# EAGLE design Omni-BASIC-TOP (EAGLE 9.6.2)
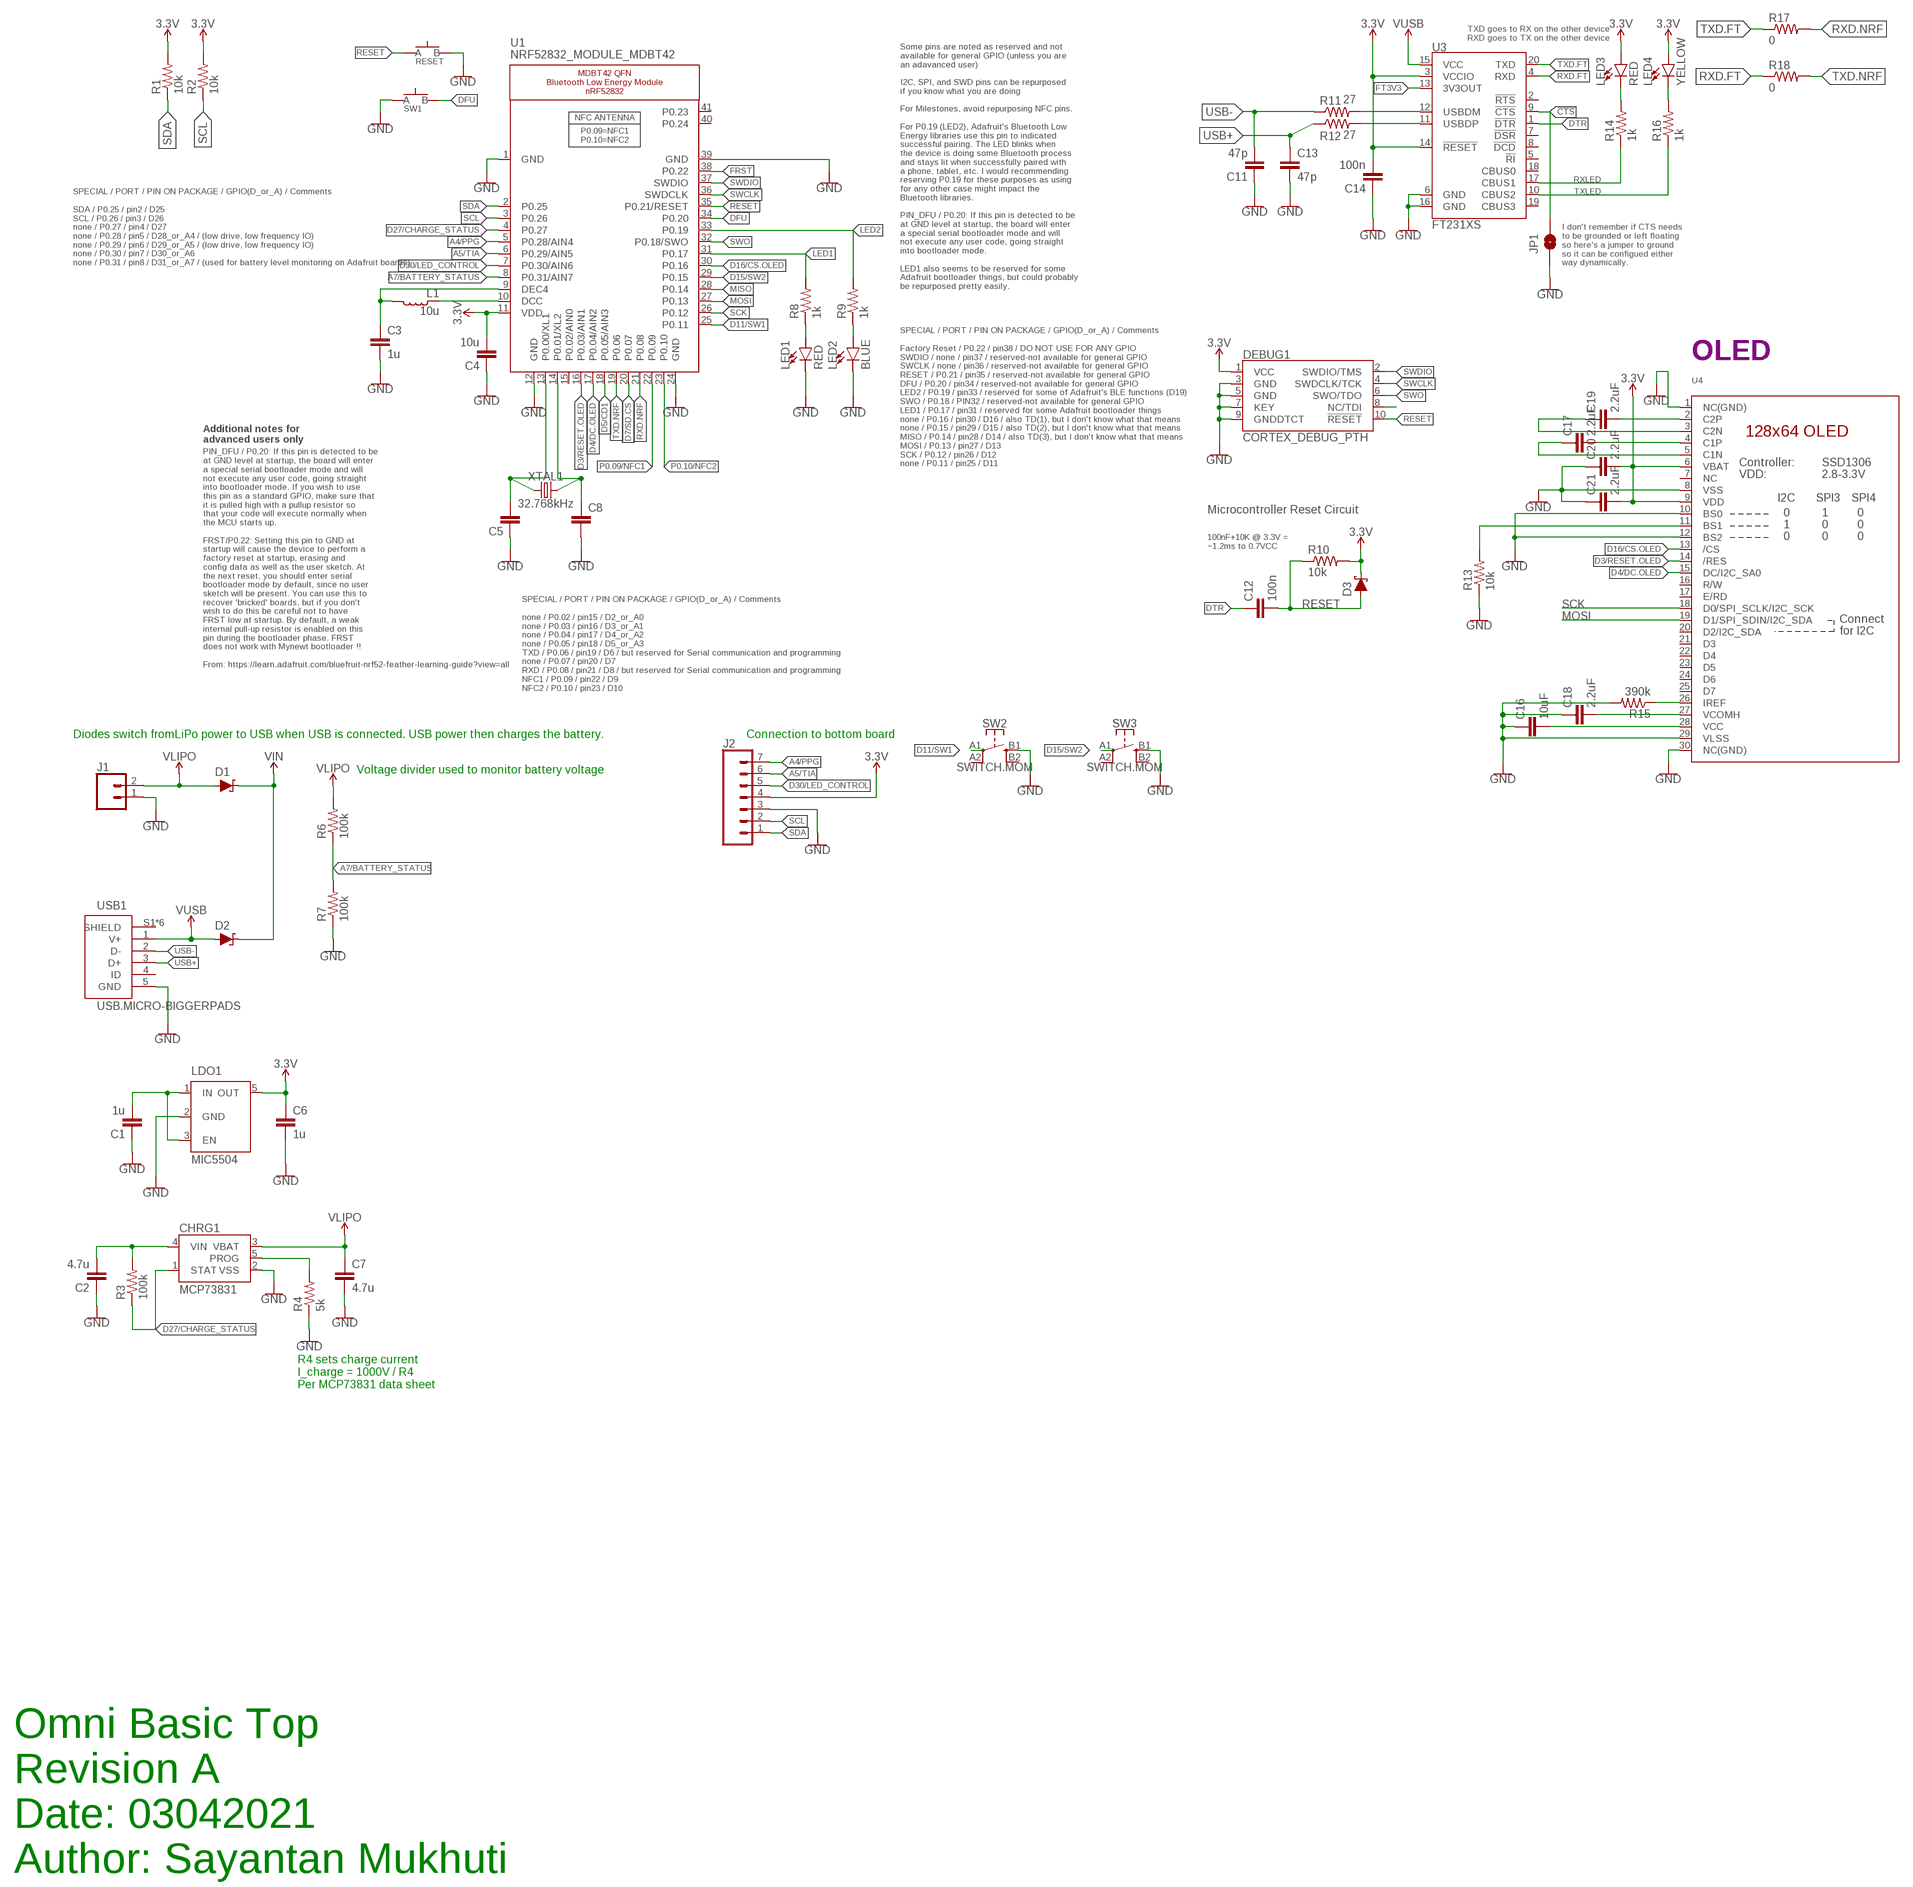
[diagram p0: schematic, sheet 1]

## Parts
C1  1u  CAPACITOR0603  [C0603]
C2  4.7u  CAPACITOR0603  [C0603]
C3  1u  CAPACITOR0603  [C0603]
C4  10u  CAPACITOR0805  [C0805]
C5  CAPACITOR0603  [C0603]
C6  1u  CAPACITOR0603  [C0603]
C7  4.7u  CAPACITOR0603  [C0603]
C8  CAPACITOR0603  [C0603]
C11  47p  CAPACITOR0603  [C0603]
C12  100n  CAPACITOR0603  [C0603]
C13  47p  CAPACITOR0603  [C0603]
C14  100n  CAPACITOR0603  [C0603]
C16  10uF  CAPACITOR0603  [C0603]
C17  2.2uF  CAPACITOR0402  [C0402]
C18  2.2uF  CAPACITOR0402  [C0402]
C19  2.2uF  CAPACITOR0402  [C0402]
C20  2.2uF  CAPACITOR0402  [C0402]
C21  2.2uF  CAPACITOR0402  [C0402]
CHRG1  MCP73831  [SOT23-5]
D1  SCHOTTKY-USC  [USC]
D2  SCHOTTKY-USC  [USC]
D3  SCHOTTKY-USC  [USC]
DEBUG1  CORTEX_DEBUG_PTH  [2X5-PTH-1.27MM]
J1  CONN_02  [1X02]
J2  CONN_07-1.27MM  [1X07_1.27MM]
JP1  JUMPER-SMT_2_NO_SILK  [SMT-JUMPER_2_NO_SILK]
L1  10u  INDUCTOR0603  [L0603]
LDO1  MIC5504  [SOT23-5]
LED1  RED  LED0603  [LED-0603]
LED2  BLUE  LED0603  [LED-0603]
LED3  RED  LED0603  [LED-0603]
LED4  YELLOW  LED0603  [LED-0603]
R1  10k  RESISTOR0603  [R0603]
R2  10k  RESISTOR0603  [R0603]
R3  100k  RESISTOR0603  [R0603]
R4  5k  RESISTOR0603  [R0603]
R6  100k  RESISTOR0603  [R0603]
R7  100k  RESISTOR0603  [R0603]
R8  1k  RESISTOR0603  [R0603]
R9  1k  RESISTOR0603  [R0603]
R10  10k  RESISTOR0603  [R0603]
R11  27  RESISTOR0603  [R0603]
R12  27  RESISTOR0603  [R0603]
R13  10k  RESISTOR0603  [R0603]
R14  1k  RESISTOR0603  [R0603]
R15  390k  RESISTOR0603  [R0603]
R16  1k  RESISTOR0603  [R0603]
R17  0  RESISTOR0603  [R0603]
R18  0  RESISTOR0603  [R0603]
RESET  SPST-PTS830GG140-COPY.1-3  [BUTTON-GULLWING]
SW1  SPST-PTS830GG140-COPY.1-3  [BUTTON-GULLWING]
SW2  SWITCH.MOM  [TACTILE_SWITCH_SMD_6.2MM_TALL]
SW3  SWITCH.MOM  [TACTILE_SWITCH_SMD_6.2MM_TALL]
U1  NRF52832_MODULE_MDBT42  [BLE_MODULE_RAYTAC_MDBT42]
U3  FT231XS  [SSOP20_L]
U4  DISP_OLED_UG-2864HSWEG01-NO-WRAPAROUND  [UG-2864HSWEG01_0.96IN_NO-WRAPAROUND]
USB1  USB.MICRO-BIGGERPADS  [USB-MICRO-01.BIGGERPADS]
XTAL1  32.768kHz  CRYSTALECS-.327-12.5-12-C-TR  [2-SMD.NOLEAD.2.0MMTO1.2MM]

## Nets
3.3V: C4.2 C6.1 C14.2 C20.2 C21.2 D3.-(C) DEBUG1.1(VCC) J2.4 LDO1.5(OUT) LED3.A LED4.A R1.2 R2.2 R10.2 U1.11(VDD) U3.3(VCCIO) U3.14(!RESET) U4.6(VBAT) U4.9(VDD)
!CTS: JP1.2 U3.9(!CTS)
A4/PPG: J2.7 U1.5(P0.28/AIN4)
A5/TIA: J2.6 U1.6(P0.29/AIN5)
A7/BATTERY_STATUS: R6.1 R7.2 U1.8(P0.31/AIN7)
D3/RESET.OLED: U1.16(P0.03/AIN1) U4.14(/RES)
D4/DC.OLED: U1.17(P0.04/AIN2) U4.15(DC/I2C_SA0)
D5/CD1: U1.18(P0.05/AIN3)
D7/SD.CS: U1.20(P0.07)
D11/SW1: SW2.A1 U1.25(P0.11)
D15/SW2: SW3.A1 U1.29(P0.15)
D16/CS.OLED: U1.30(P0.16) U4.13(/CS)
D27/CHARGE_STATUS: CHRG1.1(STAT) R3.1 U1.4(P0.27)
D30/LED_CONTROL: J2.5 U1.7(P0.30/AIN6)
DFU: SW1.3(B) U1.34(P0.20)
DTR: C12.1 U3.1(!DTR)
FRST: U1.38(P0.22)
FT3V3: U3.13(3V3OUT)
GND: C1.1 C2.1 C3.2 C4.1 C5.1 C6.2 C7.2 C8.2 C11.1 C13.2 C14.1 C16.1 C18.1 C20.1 C21.1 CHRG1.2(VSS) DEBUG1.3(GND) DEBUG1.5(GND) DEBUG1.7(KEY) DEBUG1.9(GNDDTCT) J1.1 J2.3 JP1.1 LDO1.2(GND) LED1.C LED2.C R4.1 R7.1 R13.1 R15.2 RESET.3(B) SW1.1(A) SW2.B1 SW3.B1 U1.1(GND) U1.12(GND) U1.24(GND) U1.39(GND) U3.6(GND) U3.16(GND) U4.1(NC(GND)) U4.8(VSS) U4.10(BS0) U4.12(BS2) U4.29(VLSS) U4.30(NC(GND)) USB1.5(GND)
LED1: R8.2 U1.31(P0.17)
LED2: R9.2 U1.33(P0.19)
MISO: U1.28(P0.14)
MOSI: U1.27(P0.13) U4.19(D1/SPI_SDIN/I2C_SDA)
N$1: R13.2 U4.11(BS1)
N$2: R15.1 U4.26(IREF)
N$3: C19.2 U4.2(C2P)
N$4: C5.2 U1.13(P0.00/XL1) XTAL1.P$1
N$5: C19.1 U4.3(C2N)
N$6: C8.1 U1.14(P0.01/XL2) XTAL1.P$2
N$7: C17.2 U4.4(C1P)
N$8: C17.1 U4.5(C1N)
N$9: LED1.A R8.1
N$10: LED2.A R9.1
N$11: L1.1 U1.10(DCC)
N$12: C3.1 L1.2 U1.9(DEC4)
N$13: C16.2 U4.28(VCC)
N$14: DEBUG1.8(NC/TDI)
N$15: C18.2 U4.27(VCOMH)
N$16: CHRG1.5(PROG) R4.2
N$23: R11.2 U3.12(USBDM)
N$24: R12.2 U3.11(USBDP)
N$25: LED3.C R14.2
N$26: LED4.C R16.2
P0.09/NFC1: U1.22(P0.09)
P0.10/NFC2: U1.23(P0.10)
RESET: C12.2 D3.+(A) DEBUG1.10(!RESET) R10.1 RESET.1(A) U1.35(P0.21/RESET)
RXD.FT: R18.1 U3.4(RXD)
RXD.NRF: R17.2 U1.21(P0.08)
RXLED: R14.1 U3.17(CBUS1)
SCK: U1.26(P0.12) U4.18(D0/SPI_SCLK/I2C_SCK)
SCL: J2.2 R2.1 U1.3(P0.26)
SDA: J2.1 R1.1 U1.2(P0.25)
SWCLK: DEBUG1.4(SWDCLK/TCK) U1.36(SWDCLK)
SWDIO: DEBUG1.2(SWDIO/TMS) U1.37(SWDIO)
SWO: DEBUG1.6(SWO/TDO) U1.32(P0.18/SWO)
TXD.FT: R17.1 U3.20(TXD)
TXD.NRF: R18.2 U1.19(P0.06)
TXLED: R16.1 U3.10(CBUS2)
USB+: C13.1 R12.1 USB1.3(D+)
USB-: C11.2 R11.1 USB1.2(D-)
V_USB: D2.+(A) U3.15(VCC) USB1.1(V+) ; supply symbol labelled VUSB
VIN: C1.2 C2.2 CHRG1.4(VIN) D1.-(C) D2.-(C) LDO1.1(IN) LDO1.3(EN) R3.2
VLIPO: C7.1 CHRG1.3(VBAT) D1.+(A) J1.2 R6.2
Unconnected: SW2.A2 SW2.B2 SW3.A2 SW3.B2 U1.15(P0.02/AIN0) U1.40(P0.24) U1.41(P0.23) U3.2(!RTS) U3.5(!RI) U3.7(!DSR) U3.8(!DCD) U3.18(CBUS0) U3.19(CBUS3) U4.7(NC) U4.16(R/W) U4.17(E/RD) U4.20(D2/I2C_SDA) U4.21(D3) U4.22(D4) U4.23(D5) U4.24(D6) U4.25(D7) USB1.4(ID) USB1.S1(SHIELD) USB1.S2(SHIELD) USB1.S3(SHIELD) USB1.S4(SHIELD) USB1.S5(SHIELD) USB1.S6(SHIELD)

## Notes on the sheet
- TXD goes to RX on the other device
  RXD goes to TX on the other device
- SPECIAL / PORT / PIN ON PACKAGE / GPIO(D_or_A) / Comments
  
  SDA / P0.25 / pin2 / D25
  SCL / P0.26 / pin3 / D26
  none / P0.27 / pin4 / D27
  none / P0.28 / pin5 / D28_or_A4 / (low drive, low frequency IO)
  none / P0.29 / pin6 / D29_or_A5 / (low drive, low frequency IO)
  none / P0.30 / pin7 / D30_or_A6
  none / P0.31 / pin8 / D31_or_A7 / (used for battery level monitoring on Adafruit boards)
- I don't remember if CTS needs
  to be grounded or left floating
  so here's a jumper to ground
  so it can be configued either
  way dynamically.
- Some pins are noted as reserved and not
  available for general GPIO (unless you are
  an adavanced user)
  
  I2C, SPI, and SWD pins can be repurposed
  if you know what you are doing
  
  For Milestones, avoid repurposing NFC pins.
  
  For P0.19 (LED2), Adafruit's Bluetooth Low
  Energy libraries use this pin to indicated
  successful pairing. The LED blinks when
  the device is doing some Bluetooth process
  and stays lit when successfully paired with
  a phone, tablet, etc. I would recommending
  reserving P0.19 for these purposes as using
  for any other case might impact the
  Bluetooth libraries.
  
  PIN_DFU / P0.20: If this pin is detected to be
  at GND level at startup, the board will enter
  a special serial bootloader mode and will
  not execute any user code, going straight
  into bootloader mode.
  
  LED1 also seems to be reserved for some
  Adafruit bootloader things, but could probably
  be repurposed pretty easily.
- OLED
- Additional notes for
  advanced users only
- SPECIAL / PORT / PIN ON PACKAGE / GPIO(D_or_A) / Comments
  
  Factory Reset / P0.22 / pin38 / DO NOT USE FOR ANY GPIO
  SWDIO / none / pin37 / reserved-not available for general GPIO
  SWCLK / none / pin36 / reserved-not available for general GPIO
  RESET / P0.21 / pin35 / reserved-not available for general GPIO
  DFU / P0.20 / pin34 / reserved-not available for general GPIO
  LED2 / P0.19 / pin33 / reserved for some of Adafruit's BLE functions (D19)
  SWO / P0.18 / PIN32 / reserved-not available for general GPIO
  LED1 / P0.17 / pin31 / reserved for some Adafruit bootloader things
  none / P0.16 / pin30 / D16 / also TD(1), but I don't know what that means
  none / P0.15 / pin29 / D15 / also TD(2), but I don't know what that means
  MISO / P0.14 / pin28 / D14 / also TD(3), but I don't know what that means
  MOSI / P0.13 / pin27 / D13
  SCK / P0.12 / pin26 / D12
  none / P0.11 / pin25 / D11
- Microcontroller Reset Circuit
- 100nF+10K @ 3.3V =
  ~1.2ms to 0.7VCC
- PIN_DFU / P0.20: If this pin is detected to be
  at GND level at startup, the board will enter
  a special serial bootloader mode and will
  not execute any user code, going straight
  into bootloader mode. If you wish to use
  this pin as a standard GPIO, make sure that
  it is pulled high with a pullup resistor so
  that your code will execute normally when
  the MCU starts up.
  
  FRST/P0.22: Setting this pin to GND at
  startup will cause the device to perform a
  factory reset at startup, erasing and
  config data as well as the user sketch. At
  the next reset, you should enter serial
  bootloader mode by default, since no user
  sketch will be present. You can use this to
  recover 'bricked' boards, but if you don't
  wish to do this be careful not to have
  FRST low at startup. By default, a weak
  internal pull-up resistor is enabled on this
  pin during the bootloader phase. FRST
  does not work with Mynewt bootloader !!
  
  From: https://learn.adafruit.com/bluefruit-nrf52-feather-learning-guide?view=all
- SPECIAL / PORT / PIN ON PACKAGE / GPIO(D_or_A) / Comments
  
  none / P0.02 / pin15 / D2_or_A0
  none / P0.03 / pin16 / D3_or_A1
  none / P0.04 / pin17 / D4_or_A2
  none / P0.05 / pin18 / D5_or_A3
  TXD / P0.06 / pin19 / D6 / but reserved for Serial communication and programming
  none / P0.07 / pin20 / D7
  RXD / P0.08 / pin21 / D8 / but reserved for Serial communication and programming
  NFC1 / P0.09 / pin22 / D9
  NFC2 / P0.10 / pin23 / D10
- Diodes switch fromLiPo power to USB when USB is connected. USB power then charges the battery. | Connection to bottom board
- Voltage divider used to monitor battery voltage
- R4 sets charge current
  I_charge = 1000V / R4
  Per MCP73831 data sheet
- Omni Basic Top
  Revision A
  Date: 03042021
  Author: Sayantan Mukhuti

## Library data of the parts
C1-C8 C11-C14 = LinnesLab-Passives:CAPACITOR
C16-C21 = LinnesLab-Passives:CAPACITOR; SPICEPREFIX: C
CHRG1 = LinnesLab-Power:MCP73831: MCP73831T Li-Ion, Li-Pol Controller Miniature single cell, fully integrated Li-Ion, Li-polymer charge management controller Datasheet <http://ww1.microchip.com/downloads/en/DeviceDoc/20001984g.pdf> SparkFun Products: SparkFun ESP32 Thing <https://www.sparkfun.com/products/13907> SparkFun 9DoF Razor IMU M0 <https://www.sparkfun.com/products/14001>; PROD_ID: IC-09995
D1-D3 = LinnesLab-DiscreteSemi:SCHOTTKY: Schottky diode A Schottky diode is a semiconductor diode which has a low forward voltage drop and a very fast switching action. Example: Digi-Key Part Number: RB161MM-20CT-ND
DEBUG1 = LinnesLab-Connectors:CORTEX_DEBUG: Cortex Debug Connector - 10 pin Supports JTAG debug, Serial Wire debug, and Serial Wire Viewer. PTH and SMD connector options available. General Connector Information <http://infocenter.arm.com/help/topic/com.arm.doc.faqs/attached/13634/cortex_debug_connectors.pdf> Products: PTH Connector <http://www.digikey.com/product-detail/en/cnc-tech/3220-10-0100-00/1175-1627-ND/3883661> -via Digi-Key SparkFun PSoc <https://www.sparkfun.com/products/13229> SparkFun T <https://www.sparkfun.com/products/13810>
J1 = LinnesLab-Connectors:CONN_02: Multi connection point. Often used as Generic Header-pin footprint for 0.1 inch spaced/style header connections On any of the 0.1 inch spaced packages, you can populate with these: Break Away Headers - Straight <https://www.sparkfun.com/products/116> (PRT-00116) Break Away Male Headers - Right Angle <https://www.sparkfun.com/products/553> (PRT-00553) Female Headers <https://www.sparkfun.com/products/115> (PRT-00115) Break Away Headers - Machine Pin <https://www.sparkfun.com/products/117> (PRT-00117) Break Away Female Headers - Swiss Machine Pin <https://www.sparkfun.com/products/743> (PRT-00743) For SCREWTERMINALS and SPRING TERMINALS visit here: Screw Terimnals on SparkFun.com <https://www.sparkfun.com/search/results?term=Screw+Terminals> (5mm/3.5mm/2.54mm spacing) This device is also useful as a general connection point to wire up your design to another part of your project. Our various solder wires solder well into these plated through hole pads. Hook-Up Wire - Assortment (Stranded, 22 AWG) <https://www.sparkfun.com/products/11375> (PRT-11375) Hook-Up Wire - Assortment (Solid Core, 22 AWG) <https://www.sparkfun.com/products/11367> (PRT-11367) View the entire wire category on our website here <https://www.sparkfun.com/categories/141> Special notes: Molex polarized connector foot print use with: PRT-08233 with associated crimp pins and housings. 2.54_SCREWTERM for use with PRT-10571. 3.5mm Screw Terminal footprints for PRT-08084 5mm Screw Terminal footprints for use with PRT-08432
J2 = LinnesLab-Connectors:CONN_07: Multi connection point. Often used as Generic Header-pin footprint for 0.1 inch spaced/style header connections On any of the 0.1 inch spaced packages, you can populate with these: Break Away Headers - Straight <https://www.sparkfun.com/products/116> (PRT-00116) Break Away Male Headers - Right Angle <https://www.sparkfun.com/products/553> (PRT-00553) Female Headers <https://www.sparkfun.com/products/115> (PRT-00115) Break Away Headers - Machine Pin <https://www.sparkfun.com/products/117> (PRT-00117) Break Away Female Headers - Swiss Machine Pin <https://www.sparkfun.com/products/743> (PRT-00743) For SCREWTERMINALS and SPRING TERMINALS visit here: Screw Terimnals on SparkFun.com <https://www.sparkfun.com/search/results?term=Screw+Terminals> (5mm/3.5mm/2.54mm spacing) This device is also useful as a general connection point to wire up your design to another part of your project. Our various solder wires solder well into these plated through hole pads. Hook-Up Wire - Assortment (Stranded, 22 AWG) <https://www.sparkfun.com/products/11375> (PRT-11375) Hook-Up Wire - Assortment (Solid Core, 22 AWG) <https://www.sparkfun.com/products/11367> (PRT-11367) View the entire wire category on our website here <https://www.sparkfun.com/categories/141> Special notes: Molex polarized connector foot print use with SKU : PRT-08231 with associated crimp pins and housings. 1MM SMD Version SKU: PRT-10208 NOTES ON THE VARIANTS LOCK and LOCK_LONGPADS... This footprint was designed to help hold the alignment of a through-hole component (i.e. 6-pin header) while soldering it into place. You may notice that each hole has been shifted either up or down by 0.005 of an inch from it's more standard position (which is a perfectly straight line). This slight alteration caused the pins (the squares in the middle) to touch the edges of the holes. Because they are alternating, it causes a "brace" to hold the component in place. 0.005 has proven to be the perfect amount of "off-center" position when using our standard breakaway headers. Although looks a little odd when you look at the bare footprint, once you have a header in there, the alteration is very hard to notice. Also,if you push a header all the way into place, it is covered up entirely on the bottom side.
JP1 = LinnesLab-Switches:JUMPER-SMT_2_NO: Normally open jumper This jumper has two pads in close proximity to each other. Apply solder to close the connection. Round pads are easier to solder for beginners, but are a lot larger. SparkFun Product that uses the round pads: SparkFun EL Sequencer <https://www.sparkfun.com/products/12781>
L1 = LinnesLab-Passives:INDUCTOR
LDO1 = LinnesLab-Power:MIC5504: MIC5504 Voltage Regulator Output Voltages: 1.0V to 3.3V Input Voltages: 2.5V to 5.5V Link to Datasheet http://ww1.microchip.com/downloads/en/DeviceDoc/MIC550X.pdf
LED1-LED4 = LinnesLab-LED:LED: LED (Generic) Standard schematic elements and footprints for 5mm, 3mm, 1206, and 0603 sized LEDs. Generic LEDs with no color specified. LTST-C190KGKT: arrow indicates cathode
R1-R4 R6-R12 R14 R16-R18 = LinnesLab-Passives:RESISTOR
R13 R15 = LinnesLab-Passives:RESISTOR; SPICEPREFIX: R
RESET SW1 = LinnesLab-Switches:SPST-PTS830GG140-COPY
SW2 SW3 = LinnesLab-Switches:SWITCH.MOM: PTS645SM43SMTR92 LFS
U1 = LinnesLab-Microcontrollers:NRF52832_MODULE_MDBT42: MDBT42 - BLE Module (nRF52832 QFN) VDD: 1.7-3.6V
U3 = LinnesLab-DigitalIC:FT231X: FTDI FT231X Full Speed USB to Full-handshake UART This USB2.0 Full Speed IC offers a compact bridge to full handshake UART interfaces. The device is a UART, capable of operating up to 3MBaud, with low power consumption (8mA). The FT231X includes the complete FT-X series feature set and enables USB to be added into a system design quickly and easily over a UART interface. Datasheet <http://cdn.sparkfun.com/datasheets/Components/General%20IC/DS_FT231X.pdf>; DIGIKEY: 768-1156-5-ND; MFN: FT231XS-U
U4 = LinnesLab-Displays:DISP_OLED_UG-2864HSWEG01: UG-2864HSWEG01 OLED display Both 1.3" and 0.96" models share the same FPC tab footprint, only the screen dimensions vary.; SPICEPREFIX: X
USB1 = LinnesLab-Connectors:USB.MICRO: DigiKey PN: 609-4613-1-ND
XTAL1 = LinnesLab-Clocks:CRYSTAL; DIGIKEY: XC2288CT-ND; FREQ: 32.7680KHZ; LOAD_CAP: 12.5pF

## Board
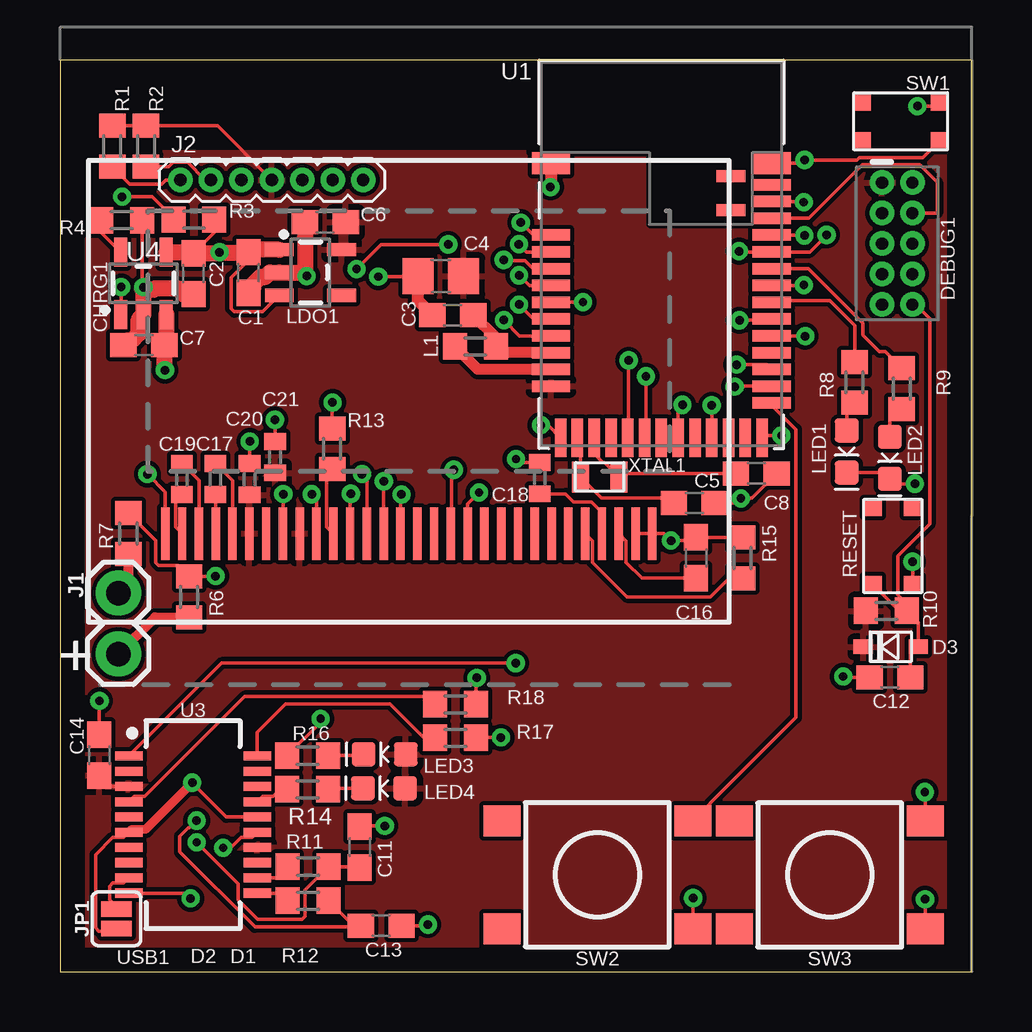
[diagram p1: board, top side]
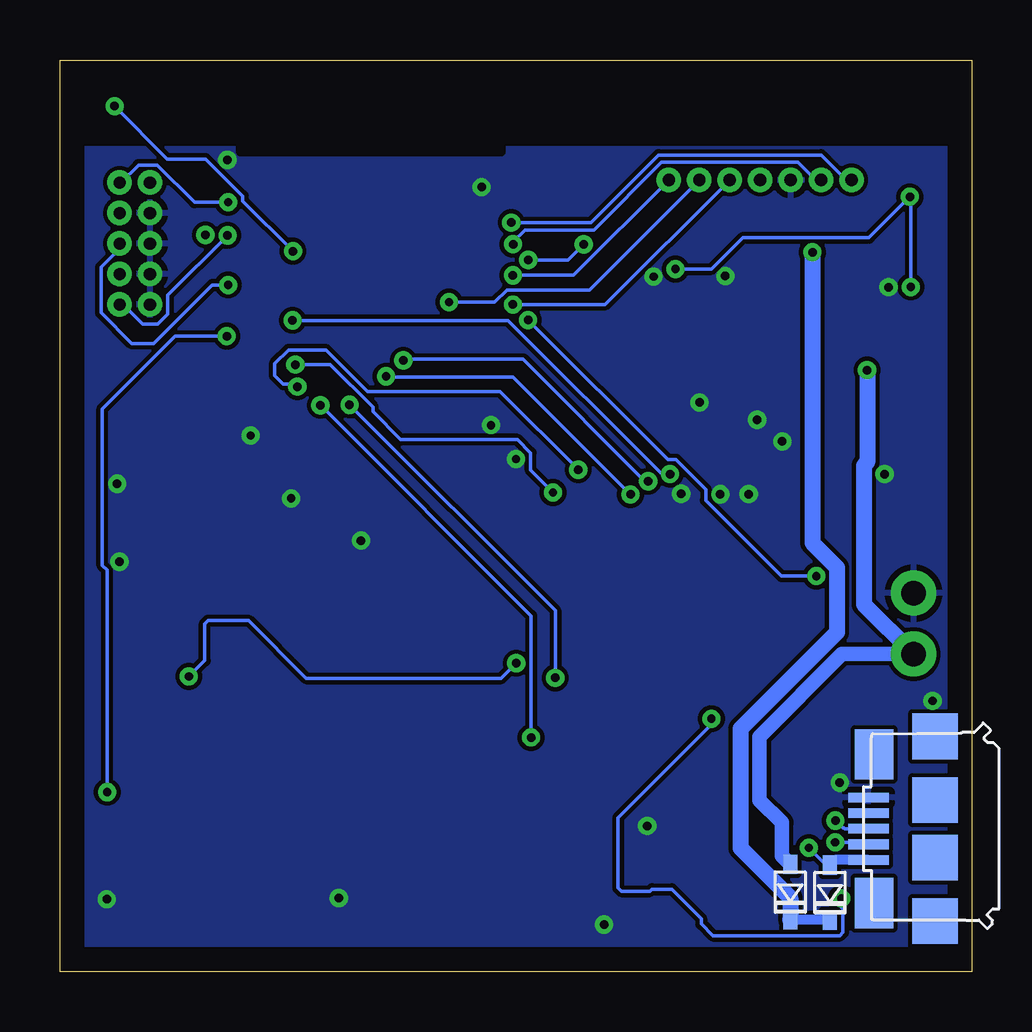
[diagram p2: board, bottom side, seen from below]

Size 38.02 x 38 mm. Coordinates in mm from the lower left corner, seen from the top.
Outline: 0,0 38,0 38.02,38 0.02,38 0,0
Copper layers (1*16): Top 0.035mm / dielectric 1.5mm / Bottom 0.035mm
Design rules "default": minimum track width 6mil, minimum drill 0.35mm, track to track 6mil, track to pad 6mil, pad to pad 6mil, via to via 6mil, smd to smd 6mil, copper to edge 40mil, drill to drill 6mil, minimum pad ring 10mil, minimum via ring 8mil, stop-mask expansion 4mil, vias tented up to drill 0mil, thermal gap 10mil

### Footprints (pad centres in the part's own frame; a part is rotated, then mirrored left to right if it is on the bottom)
C0603 = smd 1.1 x 1: 1 -0.85,0; 2 0.85,0
C0805 = smd 1.3 x 1.5: 1 -0.95,0; 2 0.95,0
C0402 = smd 0.7 x 0.9: 1 -0.65,0; 2 0.65,0
SOT23-5 = smd 0.55 x 1.2: 1 -0.95,-1.3; 2 0,-1.3; 3 0.95,-1.3; 4 0.95,1.3; 5 -0.95,1.3
USC = smd 0.8 x 0.6: + -1.15,0; - 1.15,0
2X5-PTH-1.27MM = drill 0.508 pad 1: 1 -2.54,-0.635; 2 -2.54,0.635; 3 -1.27,-0.635; 4 -1.27,0.635; 5 0,-0.635; 6 0,0.635; 7 1.27,-0.635; 8 1.27,0.635; 9 2.54,-0.635; 10 2.54,0.635
1X02 = drill 1.016 pad 1.88: 1 0,0; 2 2.54,0
1X07_1.27MM = drill 0.508 pad 1: 1 0,0; 2 1.27,0; 3 2.54,0; 4 3.81,0; 5 5.08,0; 6 6.35,0; 7 7.62,0
SMT-JUMPER_2_NO_SILK = smd 0.635 x 1.27: 1 -0.406,0; 2 0.406,0
L0603 = smd 1 x 1.1: 1 -0.85,0; 2 0.85,0
LED-0603 = smd 1 x 1: A -0.877,0; C 0.877,0
R0603 = smd 1 x 1.1: 1 -0.85,0; 2 0.85,0
BUTTON-GULLWING = smd 0.7 x 0.75: 1 -1.6,0.825; 2 1.6,0.825; 3 -1.6,-0.825; 4 1.6,-0.825
TACTILE_SWITCH_SMD_6.2MM_TALL = smd 1.55 x 1.3: A1 -3.975,-2.25; A2 3.975,-2.25; B1 -3.975,2.25; B2 3.975,2.25
BLE_MODULE_RAYTAC_MDBT42 = smd 1.6 x 0.9: 1 -4.6,3.8; 39 4.6,3.8 | smd 1.6 x 0.48: 2 -4.6,0.8; 3 -4.6,0.1; 4 -4.6,-0.6; 5 -4.6,-1.3; 6 -4.6,-2; 7 -4.6,-2.7; 8 -4.6,-3.4; 9 -4.6,-4.1; 10 -4.6,-4.8; 11 -4.6,-5.5; 25 4.6,-6.2; 26 4.6,-5.5; 27 4.6,-4.8; 28 4.6,-4.1; 29 4.6,-3.4; 30 4.6,-2.7; 31 4.6,-2; 32 4.6,-1.3; 33 4.6,-0.6; 34 4.6,0.1; 35 4.6,0.8; 36 4.6,1.5; 37 4.6,2.2; 38 4.6,2.9 | smd 0.48 x 1.6: 12 -4.2,-7.65; 13 -3.5,-7.65; 14 -2.8,-7.65; 15 -2.1,-7.65; 16 -1.4,-7.65; 17 -0.7,-7.65; 18 0,-7.65; 19 0.7,-7.65; 20 1.4,-7.65; 21 2.1,-7.65; 22 2.8,-7.65; 23 3.5,-7.65; 24 4.2,-7.65 | smd 1.2 x 0.5: 40 2.9,3.25; 41 2.9,1.85
SSOP20_L = smd 0.381 x 1.143: 1 -2.857,-2.68; 2 -2.223,-2.68; 3 -1.587,-2.68; 4 -0.953,-2.68; 5 -0.318,-2.68; 6 0.318,-2.68; 7 0.953,-2.68; 8 1.587,-2.68; 9 2.223,-2.68; 10 2.857,-2.68; 11 2.857,2.68; 12 2.223,2.68; 13 1.587,2.68; 14 0.953,2.68; 15 0.318,2.68; 16 -0.318,2.68; 17 -0.953,2.68; 18 -1.587,2.68; 19 -2.223,2.68; 20 -2.857,2.68
UG-2864HSWEG01_0.96IN_NO-WRAPAROUND = smd 0.35 x 2.2: 1 -10.15,-1.2; 2 -9.45,-1.2; 3 -8.75,-1.2; 4 -8.05,-1.2; 5 -7.35,-1.2; 6 -6.65,-1.2; 7 -5.95,-1.2; 8 -5.25,-1.2; 9 -4.55,-1.2; 10 -3.85,-1.2; 11 -3.15,-1.2; 12 -2.45,-1.2; 13 -1.75,-1.2; 14 -1.05,-1.2; 15 -0.35,-1.2; 16 0.35,-1.2; 17 1.05,-1.2; 18 1.75,-1.2; 19 2.45,-1.2; 20 3.15,-1.2; 21 3.85,-1.2; 22 4.55,-1.2; 23 5.25,-1.2; 24 5.95,-1.2; 25 6.65,-1.2; 26 7.35,-1.2; 27 8.05,-1.2; 28 8.75,-1.2; 29 9.45,-1.2; 30 10.15,-1.2
USB-MICRO-01.BIGGERPADS = smd 0.4 x 1.7: 1 -1.3,1.505; 2 -0.65,1.505; 3 0,1.505; 4 0.65,1.505; 5 1.3,1.505 | smd 1.9 x 1.9: S1 -3.85,-1.27; S2 -1.2,-1.27; S3 1.2,-1.27; S4 3.85,-1.27 | smd 2.1 x 1.6: S5 -3.1,1.28; S6 3.1,1.28
2-SMD.NOLEAD.2.0MMTO1.2MM = smd 0.7 x 1.3: P$1 -0.8,0; P$2 0.8,0

### Placement (x,y rotation side)
C1  7.86,29.14 90 top
C2  5.57,29.09 90 top
C3  16.37,27.37 180 top
C4  15.87,28.99 0 top
C5  26.44,19.54 180 top
C6  11.06,31.24 180 top
C7  3.5,26.12 180 top
C8  29.03,20.76 0 top
C11  12.49,5.19 270 top
C12  34.6,12.26 0 top
C13  13.39,1.91 0 top
C14  1.64,9.02 270 top
C16  26.52,17.25 270 top
C17  6.48,20.53 270 top
C18  20.01,20.57 270 top
C19  5.09,20.53 270 top
C20  7.91,20.53 270 top
C21  8.97,21.44 270 top
CHRG1  3.48,28.69 0 top
D1  7.57,3.32 270 bottom
D2  5.93,3.29 270 bottom
D3  34.63,13.54 180 top
DEBUG1  34.9,30.35 270 top
J1  2.44,15.78 270 top
J2  5.02,33 0 top
JP1  2.35,2.2 90 top
L1  17.32,26.06 0 top
LDO1  10.44,29.14 270 top
LED1  32.8,21.68 270 top
LED2  34.59,21.42 270 top
LED3  13.51,7.64 180 top
LED4  13.54,9.06 180 top
R1  2.18,34.41 90 top
R2  3.59,34.41 90 top
R3  5.59,31.35 0 top
R4  2.57,31.32 180 top
R6  5.38,15.61 270 top
R7  2.85,18.26 90 top
R8  33.12,24.56 90 top
R9  35.09,24.31 90 top
R10  34.45,15.04 180 top
R11  10.35,4.38 180 top
R12  10.35,2.95 180 top
R13  11.35,21.79 270 top
R14  10.32,7.6 0 top
R15  28.45,17.24 90 top
R16  10.33,9 0 top
R17  16.49,9.75 0 top
R18  16.49,11.14 0 top
RESET  34.72,17.74 90 top
SW1  35.05,35.45 180 top
SW2  22.41,4.04 180 top
SW3  32.09,4.03 180 top
U1  25.07,29.9 0 top
U3  5.55,6.13 270 top
U4  14.54,19.46 0 top
USB1  2.81,5.95 90 bottom
XTAL1  22.5,20.62 0 top

### Tracks (layer width: path | path; a pad name or v marks a point on that pad's centre or on a via)
3.3V
  Top 0.152: 1.96,8.17 C14.2 2.1,7.72 U3.3 | R1.2 R2.2 | R2.2 | R2.2 6.57,35.26 J2.4
  pour Top (isolate 0.178): 0.19,34.18 37.88,34.18 38.59,33.47 38.59,-1.36 0.15,-1.36 0.15,34.15
!CTS
  Top 0.152: U3.9 2.65,3.69 2.2,3.69 2.07,3.56 2.07,2.99 2.35,2.7 JP1.2
A4/PPG  (via drill 0.35)
  Top 0.152: U1.5 19.56,28.6 v19.14,29.02
  Bottom 0.152: v19.14,29.02 16.62,29.02 J2.7
A5/TIA  (via drill 0.35)
  Top 0.152: U1.6 v21.8,27.9 v21.8,27.91
  Bottom 0.152: v21.8,27.91 19.9,27.91 19.39,28.42 15.96,28.42 J2.6
A7/BATTERY_STATUS  (via drill 0.35)
  Top 0.152: U1.8 19.16,26.5 v18.5,27.16 | v6.49,16.49 6.46,16.46 R6.1 4.92,16.93 4.12,16.93 3.99,17.06 3.99,17.97 R7.2
  Bottom 0.152: v18.5,27.16 12.69,21.34 12.34,21.34 11.1,20.1 11.1,19.64 7.94,16.49 v6.49,16.49
D3/RESET.OLED  (via drill 0.35)
  Top 0.152: U4.14 v13.49,20.43 v13.5,20.44 | v23.71,25.48 23.71,22.29 U1.16
  Bottom 0.152: v23.71,25.48 23.66,25.53 18.72,25.53 13.61,20.42 13.52,20.42 v13.5,20.44
D4/DC.OLED  (via drill 0.35)
  Top 0.152: U4.15 14.19,19.85 v14.24,19.89 | v24.43,24.81 24.43,22.31 U1.17
  Bottom 0.152: v24.43,24.81 24.4,24.79 19.13,24.79 v14.24,19.89
D11/SW1
  Top 0.152: SW2.A1 27.11,7.02 27.11,7.03 30.68,10.59 30.68,22.6 29.67,23.61 U1.25
D15/SW2  (via drill 0.35)
  Top 0.152: U1.29 31.06,26.5 v31.07,26.49 | SW3.A1 36.07,7.47 v36.05,7.48
  Bottom 0.152: v36.05,7.48 36.05,16.74 36.25,16.94 36.25,23.45 33.22,26.49 v31.07,26.49
D16/CS.OLED  (via drill 0.35)
  Top 0.152: U4.13 12.79,20.53 v12.59,20.74 | v28.33,27.15 29.62,27.15 U1.30
  Bottom 0.152: v12.59,20.74 12.94,20.74 19.35,27.15 v28.32,27.15 v28.33,27.15
D27/CHARGE_STATUS  (via drill 0.35)
  Top 0.152: R3.1 4.74,31.41 3.85,32.3 v2.59,32.3 | v2.55,28.54 2.55,27.41 CHRG1.1 | U1.4 19.72,29.3 19.39,29.63 18.53,29.63 v18.5,29.67 | v16.19,30.31 13.39,30.31 v12.37,29.29
  Bottom 0.152: v2.55,28.54 2.55,32.26 v2.59,32.3 4.3,30.59 9.55,30.59 10.86,29.29 v12.37,29.29 | v18.5,29.67 16.83,29.67 v16.19,30.31
D30/LED_CONTROL  (via drill 0.35)
  Top 0.152: U1.7 19.75,27.2 v19.14,27.81
  Bottom 0.152: v19.14,27.81 15.29,27.81 J2.5
DFU  (via drill 0.35)
  Top 0.152: v31.96,30.71 31.25,30 U1.34 28.34,30 v28.31,30.03 | v35.75,36.08 36.46,36.08 SW1.3
  Bottom 0.152: v35.75,36.08 33.54,33.88 31.95,33.88 30.4,32.33 30.4,32.12 v28.31,30.03
DTR  (via drill 0.35)
  Top 0.152: v19,12.86 6.74,12.86 U3.1 | C12.1 32.69,12.26 v32.65,12.3
  Bottom 0.152: v32.65,12.3 31.98,12.97 31.98,14.5 31.85,14.64 30.16,14.64 27.75,12.23 19.63,12.23 v19,12.86
GND  (via drill 0.35)
  Top 0.152: U4.29 U4.30 25.18,18.26 v25.47,17.97 26.39,17.97 C16.1 R15.2 | v3.65,20.74 4.39,19.99 U4.1 | C20.1 v7.91,22.1 | v8.96,23 8.96,22.1 C21.1 | v8.96,23 | v9.31,19.9 9.29,19.89 U4.8 | R13.1 11.35,23.71 v11.36,23.73 | v10.49,19.9 10.71,19.68 10.71,18.27 U4.10 | v12.12,19.92 12.09,19.89 U4.12 | C18.1 19.16,21.22 v19.01,21.37 | SW3.B1 v36.07,3.02 | SW2.B1 26.38,3.05 v26.4,3.07 | C11.1 12.53,6.07 v13.54,6.07 | C5.1 28.2,19.54 v28.38,19.73 28.39,19.74 28.85,19.74 C8.2 | U1.12 20.34,22.78 v20.05,22.78 | LED1.C 34.33,20.81 LED2.C 34.8,20.34 v35.64,20.34 | U1.24 29.37,22.35 v30.07,22.35 | v35.54,17.08 RESET.3 | U1.39 30.91,33.7 v31.04,33.84 33.22,33.84 33.32,33.94 35.97,33.94 SW1.1 | C4.1 14.9,28.97 v13.27,28.97 | C14.1 v1.64,11.28 v1.65,11.28 | U3.16 6.94,6.45 v5.52,7.87 | U3.6 2.65,5.6 2.2,5.6 1.48,4.87 1.48,1.82 1.61,1.68 2.24,1.68 JP1.1 | C13.2 15.29,1.91 v15.34,1.96 | R4.1 3.42,28.48 3.43,28.48 3.48,28.42
  Top 0.356: U3.6 2.98,5.93 3.58,5.93 v5.52,7.87 v5.52,7.88
  Top 0.406: R7.1 2.85,16.19 J1.1
  Top 0.508: C3.2 14.92,27.97 C4.1 | U1.1 20.47,32.73 v20.44,32.71
  Top 0.66: 3.43,28.48 v3.48,28.53 | C7.2 2.84,26.31 3,26.31 3.29,26.59 3.29,27.2 CHRG1.2 3.48,28.42 3.9,28.42 3.96,28.47 4.9,28.47 5.14,28.24 C2.1 | 10.14,29.14 LDO1.2 8.74,29.14 8.56,28.96 8.35,28.96 8.06,28.67 8.06,28.49 C1.1 | 10.14,29.14 10.22,29.23 10.22,30.57 10.21,30.58 C6.2 | 10.14,29.14 v10.28,29
  pour Bottom (isolate 0.178): 0.13,34.36 37.98,34.36 38.05,34.29 38.1,34.24 38.1,-0.05 38.04,-0.11 -0.06,-0.11 -0.06,34.18 -0.05,34.18 0.12,34.36
LED1
  Top 0.152: R8.2 33.13,25.43 33.13,26.92 32.09,27.97 29.74,27.97 U1.31
LED2
  Top 0.152: R9.2 34.41,25.84 34.16,25.84 33.46,26.54 33.46,27.03 31.19,29.3 U1.33
MOSI  (via drill 0.35)
  Top 0.152: U4.19 16.99,19.5 v17.47,19.97 | U1.27 29.47,25.3 v28.21,25.3
  Bottom 0.152: v17.47,19.97 18.4,20.91 18.4,21.62 18.96,22.17 23.81,22.17 24.98,23.34 24.98,23.53 26.75,25.3 v28.21,25.3
N$1
  Top 0.152: U4.11 11.11,18.54 11.11,20.7 R13.2
N$2
  Top 0.152: U4.26 22.19,17.96 22.19,17.06 23.63,15.62 27.11,15.62 27.89,16.39 R15.1
N$3
  Top 0.152: U4.2 4.82,18.53 4.82,19.88 C19.2
N$4
  Top 0.152: U1.13 21.7,22.12 XTAL1.P$1 22.58,19.74 25.39,19.74 C5.2
N$5
  Top 0.152: U4.3 5.79,20.48 C19.1
N$6
  Top 0.152: C8.1 23.44,20.76 XTAL1.P$2 22.7,21.22 22.64,21.22 22.27,21.59 U1.14
N$7
  Top 0.152: U4.4 6.49,19.87 C17.2
N$8
  Top 0.152: U4.5 7.19,20.47 C17.1
N$9
  Top 0.152: R8.1 32.8,23.39 LED1.A
N$10
  Top 0.152: LED2.A 34.59,22.96 R9.1
N$11
  Top 0.457: U1.10 17.42,25.1 L1.1
N$12
  Top 0.457: U1.9 18.42,25.8 L1.2 18.17,26.42 C3.1
N$13
  Top 0.152: U4.28 23.59,17.96 23.59,17.06 24.25,16.4 C16.2
N$15
  Top 0.152: C18.2 21.08,19.92 21.41,19.58 22.16,19.58 22.6,19.15 U4.27
N$16
  Top 0.152: R4.2 1.72,30.8 CHRG1.5
N$23
  Top 0.152: U3.12 9.03,3.91 R11.2
N$24
  Top 0.152: U3.11 9.18,3.27 R12.2
N$25
  Top 0.152: R14.2 11.21,7.64 LED3.C
N$26
  Top 0.152: R16.2 12.6,9 LED4.C
RESET  (via drill 0.35)
  Top 0.152: C12.2 35.45,13.21 D3.+ 35.78,14.56 35.39,14.95 | 35.39,14.95 R10.1 34.99,15.04 RESET.1 | U1.35 v31.02,30.7 v31.03,30.69 | 35.39,14.95 35.39,15.24 34.94,15.7 34.94,17.34 36.25,18.65 36.25,27.22 35.66,27.81 DEBUG1.10
  Bottom 0.152: v31.03,30.69 33.52,28.2 33.52,27.42 33.95,26.99 34.56,26.99 35.39,27.81 DEBUG1.10
RXD.FT
  Top 0.152: U3.4 3.08,7.3 3.53,7.3 7.7,11.47 15.31,11.47 R18.1
RXD.NRF  (via drill 0.35)
  Top 0.152: U1.21 v27.17,23.6 v27.17,23.61 | R17.2 v18.38,9.76
  Bottom 0.152: v27.17,23.61 18.38,14.83 v18.38,9.76
RXLED
  Top 0.152: U3.17 8.44,7.3 8.89,7.3 9.2,7.6 R14.1
SCK  (via drill 0.35)
  Top 0.152: U4.18 16.33,18.29 16.33,20.84 v16.41,20.92 | v28.13,24.38 28.14,24.4 U1.26
  Bottom 0.152: v16.41,20.92 19.68,24.18 25.2,24.18 26.94,25.92 28.49,25.92 29.07,25.34 29.07,24.84 28.71,24.49 28.23,24.49 v28.13,24.38
SCL  (via drill 0.35)
  Top 0.152: U1.3 19.45,30 v19.13,30.32 | J2.2 6.06,33 5.33,33.74 4.72,33.74 4.54,33.56 R2.1
  Bottom 0.152: v19.13,30.32 19.13,30.43 18.64,30.92 15.77,30.92 12.95,33.74 7.26,33.74 6.52,33 J2.2
SDA  (via drill 0.35)
  Top 0.152: U1.2 19.73,30.7 v19.21,31.23 | J2.1 4.41,33 4.23,32.83 2.91,32.83 R1.1
  Bottom 0.152: v19.21,31.23 15.89,31.23 13.07,34.04 6.29,34.04 5.25,33 J2.1
SWCLK
  Top 0.152: U1.36 31.22,31.4 33.45,33.63 35.83,33.63 36.56,32.91 36.56,31.62 DEBUG1.4
SWDIO  (via drill 0.35)
  Top 0.152: v31.01,32.08 30.98,32.1 U1.37
  Bottom 0.152: DEBUG1.2 35.48,32.89 34.75,33.63 33.96,33.63 32.41,32.08 v31.01,32.08
SWO  (via drill 0.35)
  Top 0.152: v31.01,28.62 30.99,28.6 U1.32
  Bottom 0.152: v31.01,28.62 31.67,28.62 34.11,26.18 35.03,26.18 36.31,27.46 36.31,29.36 35.54,30.13 DEBUG1.6
TXD.FT
  Top 0.152: R17.1 15.18,9.75 13.77,11.15 9.4,11.15 8.23,9.98 U3.20
TXD.NRF  (via drill 0.35)
  Top 0.152: U1.19 25.77,23.44 v25.95,23.62 | v17.37,12.25 17.34,12.21 R18.2
  Bottom 0.152: v25.95,23.62 17.37,15.05 v17.37,12.25
TXLED  (via drill 0.35)
  Top 0.152: R16.1 10.86,10.39 v10.86,10.54 | v5.45,3.05 5.22,3.27 U3.10
  Bottom 0.152: v10.86,10.54 10.86,10.3 14.75,6.4 14.75,3.48 14.62,3.35 13.43,3.35 13.34,3.44 12.52,3.44 11.28,2.2 11.28,1.99 10.79,1.5 5.52,1.5 5.38,1.63 5.38,2.62 5.45,2.69 v5.45,3.05
USB+  (via drill 0.35)
  Top 0.152: R12.1 12.32,1.83 C13.1 12.49,1.86 8.13,1.86 4.99,4.99 4.99,5.64 5.35,5.99 5.39,5.99 v5.7,6.3
  Bottom 0.152: USB1.3 5.31,5.95 5.35,5.99 5.39,5.99 v5.7,6.3
USB-  (via drill 0.35)
  Top 0.152: C11.2 12.45,4.38 R11.1 10.23,3.4 10.23,2.31 10.09,2.18 8.24,2.18 7.43,2.99 7.43,3.66 v5.7,5.39
  Bottom 0.152: USB1.2 4.4,5.39 v5.7,5.39
V_USB  (via drill 0.35)
  Top 0.152: U3.15 8.01,5.6 7.56,5.6 7.13,5.16 v6.8,5.16
  Bottom 0.152: v6.8,5.16 6.08,4.44 D2.+
  Bottom 0.406: USB1.1 5.71,4.65 D2.+
VIN  (via drill 0.35)
  Top 0.152: R3.2 6.44,30.81 C2.2 | C1.2 7.86,29.66 7.13,28.94 7.13,27.65 7.26,27.51 8.45,27.51 LDO1.3
  Top 0.66: CHRG1.4 5.51,29.99 C2.2 6.61,29.94 | 6.61,29.94 v6.65,29.99 | LDO1.1 7.96,30.09 C1.2 7.81,29.94 6.61,29.94
  Bottom 0.406: D2.- 5.95,2.17 D1.-
  Bottom 0.66: v6.65,29.99 6.65,17.87 5.63,16.85 5.63,14.14 9.65,10.12 9.65,5.16 7.57,3.08 D1.-
VLIPO  (via drill 0.35)
  Top 0.406: J1.2 3.96,14.76 R6.2
  Top 0.66: v4.37,25.07 4.35,25.1 C7.1 4.43,26.2 CHRG1.3
  Bottom 0.61: J1.2 5.42,13.24 8.86,9.79 8.86,7.15 7.93,6.21 7.93,4.82 D1.+
  Bottom 0.66: v4.37,25.07 4.37,21.23 4.51,21.1 4.51,15.31 J1.2

### Text on the board
tNames: + | +